# Altium schematic sheet 09_RGB_LCD.SchDoc
size A4
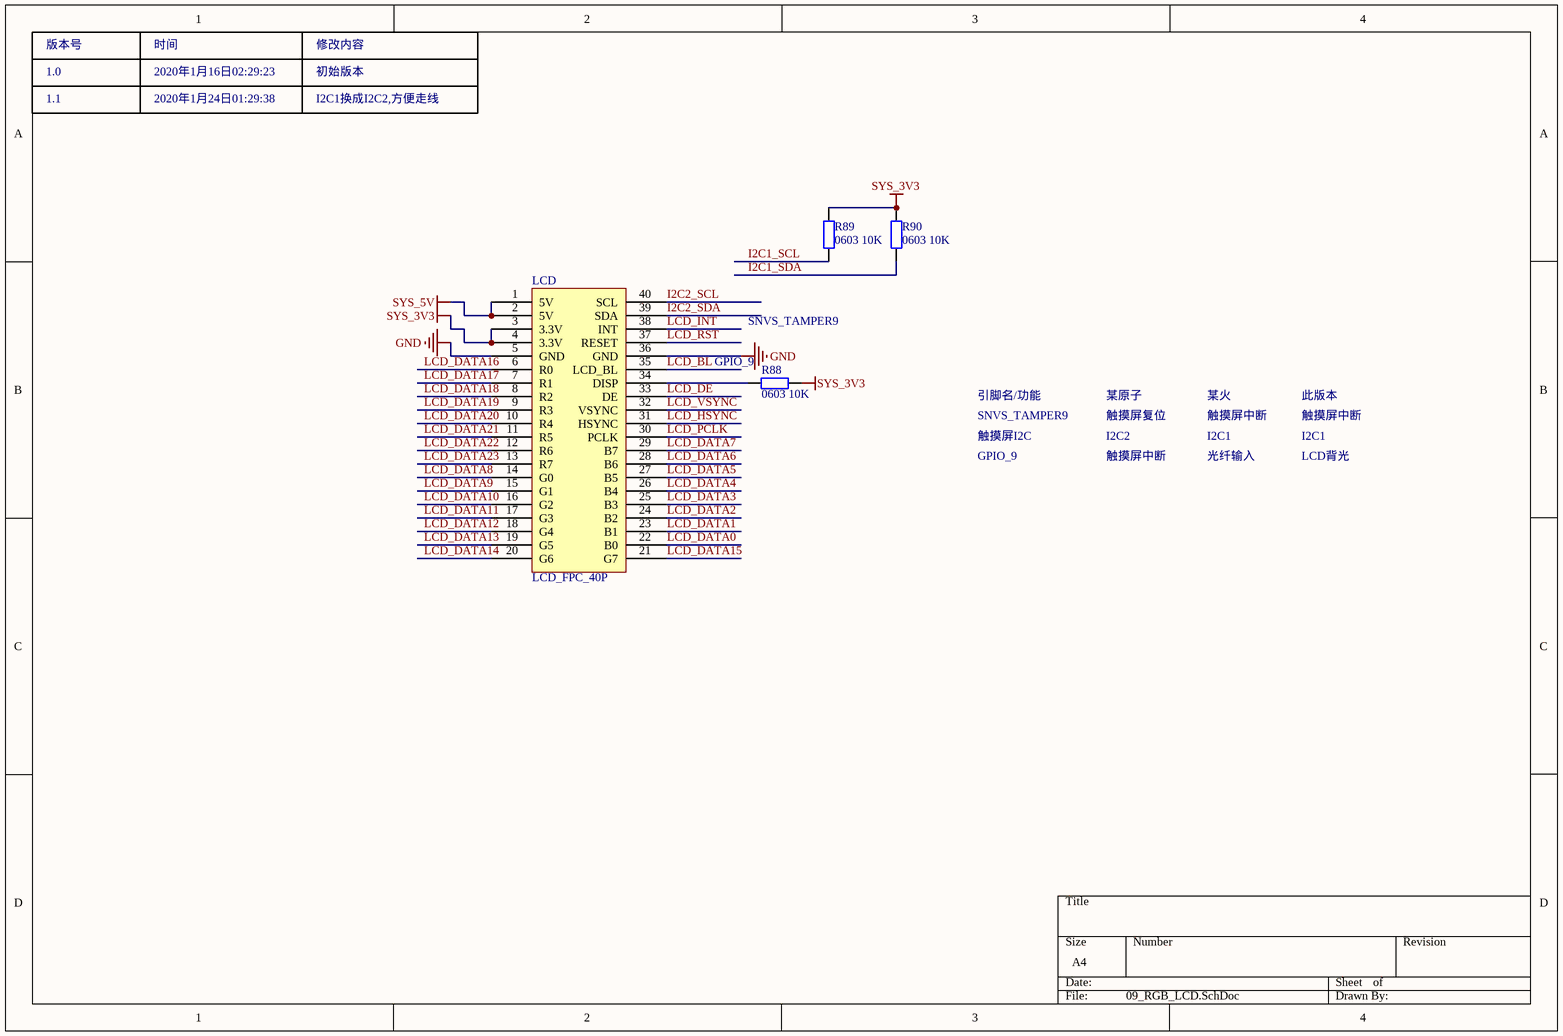
[diagram p0: 09_RGB_LCD.SchDoc]

## Parts
LCD  LCD_FPC_40P  [FPC40P_P]
R88  0603 10K  [LC-0603_R]
R89  0603 10K  [LC-0603_R]
R90  0603 10K  [LC-0603_R]

## Nets
GND: LCD.5(GND) LCD.36(GND)
SYS_3V3: LCD.3(3.3V) LCD.4(3.3V) R88.2 R89.2 R90.2
SYS_5V: LCD.1(5V) LCD.2(5V)
I2C1_SCL: R89.1
I2C1_SDA: R90.1
I2C2_SCL: LCD.40(SCL)
I2C2_SDA: LCD.39(SDA)
LCD_BL: LCD.35(LCD_BL)
LCD_DATA0: LCD.22(B0)
LCD_DATA1: LCD.23(B1)
LCD_DATA2: LCD.24(B2)
LCD_DATA3: LCD.25(B3)
LCD_DATA4: LCD.26(B4)
LCD_DATA5: LCD.27(B5)
LCD_DATA6: LCD.28(B6)
LCD_DATA7: LCD.29(B7)
LCD_DATA8: LCD.14(G0)
LCD_DATA9: LCD.15(G1)
LCD_DATA10: LCD.16(G2)
LCD_DATA11: LCD.17(G3)
LCD_DATA12: LCD.18(G4)
LCD_DATA13: LCD.19(G5)
LCD_DATA14: LCD.20(G6)
LCD_DATA15: LCD.21(G7)
LCD_DATA16: LCD.6(R0)
LCD_DATA17: LCD.7(R1)
LCD_DATA18: LCD.8(R2)
LCD_DATA19: LCD.9(R3)
LCD_DATA20: LCD.10(R4)
LCD_DATA21: LCD.11(R5)
LCD_DATA22: LCD.12(R6)
LCD_DATA23: LCD.13(R7)
LCD_DE: LCD.33(DE)
LCD_HSYNC: LCD.31(HSYNC)
LCD_INT: LCD.38(INT)
LCD_PCLK: LCD.30(PCLK)
LCD_RST: LCD.37(RESET)
LCD_VSYNC: LCD.32(VSYNC)
NetLCD_34: LCD.34(DISP) R88.1

## Notes on the sheet
- 版本号
- 1.0
- 1.1
- 2020年1月16日02:29:23
- 时间
- 2020年1月24日01:29:38
- 修改内容
- 初始版本
- I2C1换成I2C2,方便走线
- (near R88) GPIO_9
- SNVS_TAMPER9
- 引脚名/功能
- 触摸屏I2C
- 某原子
- 触摸屏复位
- I2C2
- 某火
- 触摸屏中断
- I2C1
- 此版本
- GPIO_9
- 光纤输入
- LCD背光

## Library data of the parts
R88-R90 = 0603 1.1KΩ (1101) 1%: 贴片电阻; ComponentLink1Description: 供应商链接; ComponentLink1URL: http://www.szlcsc.com/product/details_23491.html; Package: 0603; Supplier: LC; SuppliersPartNumber: C22764